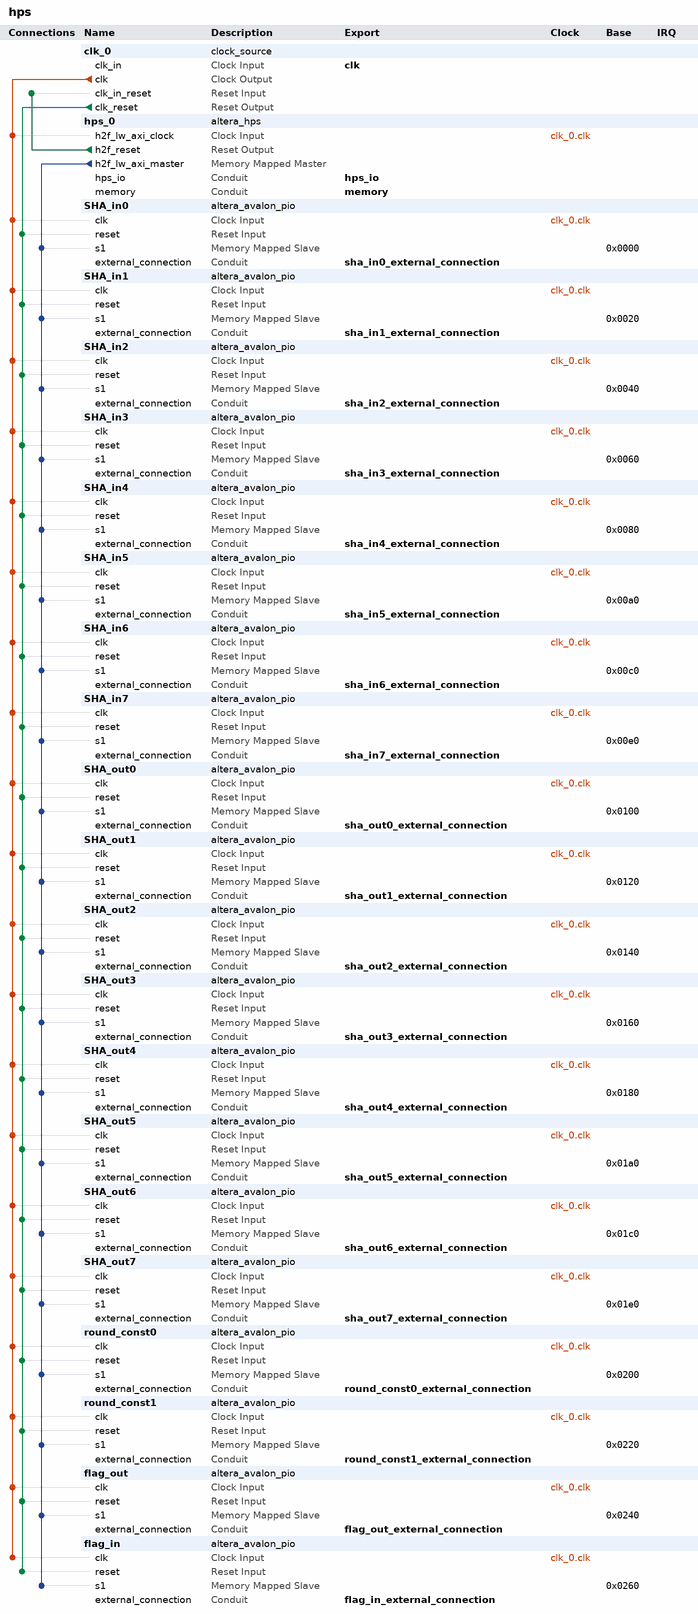
[diagram p0: system contents]
# Platform Designer (Qsys) system hps, Cyclone V 5CSXFC6D6F31C6
# Parameters at their usual value, and those the tool derives, are not listed.
package require -exact qsys 18.1
create_system hps
set_project_property DEVICE_FAMILY {Cyclone V}
set_project_property DEVICE 5CSXFC6D6F31C6

add_instance clk_0 clock_source 18.1
set_instance_parameter_value clk_0 clockFrequency 50000000

add_instance hps_0 altera_hps 18.1
set_instance_parameter_value hps_0 EMAC1_Mode RGMII
set_instance_parameter_value hps_0 EMAC1_PinMuxing {HPS I/O Set 0}
set_instance_parameter_value hps_0 F2SCLK_COLDRST_Enable false
set_instance_parameter_value hps_0 F2SCLK_DBGRST_Enable false
set_instance_parameter_value hps_0 F2SCLK_WARMRST_Enable false
set_instance_parameter_value hps_0 F2SINTERRUPT_Enable false
set_instance_parameter_value hps_0 F2S_Width 0
set_instance_parameter_value hps_0 FPGA_PERIPHERAL_OUTPUT_CLOCK_FREQ_EMAC0_GTX_CLK 125
set_instance_parameter_value hps_0 FPGA_PERIPHERAL_OUTPUT_CLOCK_FREQ_EMAC0_MD_CLK 2.5
set_instance_parameter_value hps_0 FPGA_PERIPHERAL_OUTPUT_CLOCK_FREQ_EMAC1_GTX_CLK 125
set_instance_parameter_value hps_0 FPGA_PERIPHERAL_OUTPUT_CLOCK_FREQ_EMAC1_MD_CLK 2.5
set_instance_parameter_value hps_0 HPS_PROTOCOL DDR3
set_instance_parameter_value hps_0 I2C0_Mode N/A
set_instance_parameter_value hps_0 I2C0_PinMuxing Unused
set_instance_parameter_value hps_0 I2C1_Mode N/A
set_instance_parameter_value hps_0 I2C1_PinMuxing Unused
set_instance_parameter_value hps_0 LWH2F_Enable true
set_instance_parameter_value hps_0 MEM_BANKADDR_WIDTH 3
set_instance_parameter_value hps_0 MEM_CLK_FREQ 400.0
set_instance_parameter_value hps_0 MEM_CLK_FREQ_MAX 400.0
set_instance_parameter_value hps_0 MEM_COL_ADDR_WIDTH 10
set_instance_parameter_value hps_0 MEM_DQ_WIDTH 32
set_instance_parameter_value hps_0 MEM_DRV_STR RZQ/6
set_instance_parameter_value hps_0 MEM_ROW_ADDR_WIDTH 15
set_instance_parameter_value hps_0 MEM_RTT_NOM RZQ/6
set_instance_parameter_value hps_0 MEM_RTT_WR {Dynamic ODT off}
set_instance_parameter_value hps_0 MEM_TCL 11
set_instance_parameter_value hps_0 MEM_TFAW_NS 45.0
set_instance_parameter_value hps_0 MEM_TRAS_NS 35.0
set_instance_parameter_value hps_0 MEM_TRCD_NS 13.75
set_instance_parameter_value hps_0 MEM_TRFC_NS 260.0
set_instance_parameter_value hps_0 MEM_TRP_NS 13.75
set_instance_parameter_value hps_0 MEM_VENDOR Micron
set_instance_parameter_value hps_0 MEM_WTCL 7
set_instance_parameter_value hps_0 QSPI_Mode N/A
set_instance_parameter_value hps_0 QSPI_PinMuxing Unused
set_instance_parameter_value hps_0 REF_CLK_FREQ 25.0
set_instance_parameter_value hps_0 S2FCLK_USER2CLK 5
set_instance_parameter_value hps_0 S2F_Width 0
set_instance_parameter_value hps_0 SDIO_Mode {4-bit Data}
set_instance_parameter_value hps_0 SDIO_PinMuxing {HPS I/O Set 0}
set_instance_parameter_value hps_0 SPIM1_Mode N/A
set_instance_parameter_value hps_0 SPIM1_PinMuxing Unused
set_instance_parameter_value hps_0 STM_Enable false
set_instance_parameter_value hps_0 TIMING_BOARD_AC_SKEW 0.02
set_instance_parameter_value hps_0 TIMING_BOARD_AC_TO_CK_SKEW 0.01
set_instance_parameter_value hps_0 TIMING_BOARD_DQ_TO_DQS_SKEW 0.05
set_instance_parameter_value hps_0 TIMING_BOARD_MAX_CK_DELAY 0.03
set_instance_parameter_value hps_0 TIMING_BOARD_MAX_DQS_DELAY 0.02
set_instance_parameter_value hps_0 TIMING_BOARD_SKEW_BETWEEN_DQS 0.06
set_instance_parameter_value hps_0 TIMING_BOARD_SKEW_CKDQS_DIMM_MAX 0.12
set_instance_parameter_value hps_0 TIMING_BOARD_SKEW_CKDQS_DIMM_MIN 0.06
set_instance_parameter_value hps_0 TIMING_BOARD_SKEW_WITHIN_DQS 0.01
set_instance_parameter_value hps_0 TIMING_TDH 65
set_instance_parameter_value hps_0 TIMING_TDQSCK 255
set_instance_parameter_value hps_0 TIMING_TDQSQ 125
set_instance_parameter_value hps_0 TIMING_TDS 30
set_instance_parameter_value hps_0 TIMING_TIH 140
set_instance_parameter_value hps_0 TIMING_TIS 190
set_instance_parameter_value hps_0 TIMING_TQSH 0.4
set_instance_parameter_value hps_0 UART0_Mode {No Flow Control}
set_instance_parameter_value hps_0 UART0_PinMuxing {HPS I/O Set 0}
set_instance_parameter_value hps_0 USB1_Mode SDR
set_instance_parameter_value hps_0 USB1_PinMuxing {HPS I/O Set 0}
set_instance_parameter_value hps_0 desired_cfg_clk_mhz 100.0
set_instance_parameter_value hps_0 desired_qspi_clk_mhz 400.0

add_instance SHA_in0 altera_avalon_pio 18.1
set_instance_parameter_value SHA_in0 direction Output
set_instance_parameter_value SHA_in0 width 32

add_instance SHA_in1 altera_avalon_pio 18.1
set_instance_parameter_value SHA_in1 direction Output
set_instance_parameter_value SHA_in1 width 32

add_instance SHA_in2 altera_avalon_pio 18.1
set_instance_parameter_value SHA_in2 direction Output
set_instance_parameter_value SHA_in2 width 32

add_instance SHA_in3 altera_avalon_pio 18.1
set_instance_parameter_value SHA_in3 direction Output
set_instance_parameter_value SHA_in3 width 32

add_instance SHA_in4 altera_avalon_pio 18.1
set_instance_parameter_value SHA_in4 direction Output
set_instance_parameter_value SHA_in4 width 32

add_instance SHA_in5 altera_avalon_pio 18.1
set_instance_parameter_value SHA_in5 direction Output
set_instance_parameter_value SHA_in5 width 32

add_instance SHA_in6 altera_avalon_pio 18.1
set_instance_parameter_value SHA_in6 direction Output
set_instance_parameter_value SHA_in6 width 32

add_instance SHA_in7 altera_avalon_pio 18.1
set_instance_parameter_value SHA_in7 direction Output
set_instance_parameter_value SHA_in7 width 32

add_instance SHA_out0 altera_avalon_pio 18.1
set_instance_parameter_value SHA_out0 direction Input
set_instance_parameter_value SHA_out0 width 32

add_instance SHA_out1 altera_avalon_pio 18.1
set_instance_parameter_value SHA_out1 direction Input
set_instance_parameter_value SHA_out1 width 32

add_instance SHA_out2 altera_avalon_pio 18.1
set_instance_parameter_value SHA_out2 direction Input
set_instance_parameter_value SHA_out2 width 32

add_instance SHA_out3 altera_avalon_pio 18.1
set_instance_parameter_value SHA_out3 direction Input
set_instance_parameter_value SHA_out3 width 32

add_instance SHA_out4 altera_avalon_pio 18.1
set_instance_parameter_value SHA_out4 direction Input
set_instance_parameter_value SHA_out4 width 32

add_instance SHA_out5 altera_avalon_pio 18.1
set_instance_parameter_value SHA_out5 direction Input
set_instance_parameter_value SHA_out5 width 32

add_instance SHA_out6 altera_avalon_pio 18.1
set_instance_parameter_value SHA_out6 direction Input
set_instance_parameter_value SHA_out6 width 32

add_instance SHA_out7 altera_avalon_pio 18.1
set_instance_parameter_value SHA_out7 direction Input
set_instance_parameter_value SHA_out7 width 32

add_instance round_const0 altera_avalon_pio 18.1
set_instance_parameter_value round_const0 direction Output
set_instance_parameter_value round_const0 width 32

add_instance round_const1 altera_avalon_pio 18.1
set_instance_parameter_value round_const1 direction Output
set_instance_parameter_value round_const1 width 32

add_instance flag_out altera_avalon_pio 18.1
set_instance_parameter_value flag_out direction Output
set_instance_parameter_value flag_out width 1

add_instance flag_in altera_avalon_pio 18.1
set_instance_parameter_value flag_in direction Input
set_instance_parameter_value flag_in width 1

# connections
add_connection clk_0.clk flag_in.clk clock
add_connection clk_0.clk flag_out.clk clock
add_connection clk_0.clk hps_0.h2f_lw_axi_clock clock
add_connection clk_0.clk round_const0.clk clock
add_connection clk_0.clk round_const1.clk clock
add_connection clk_0.clk SHA_in0.clk clock
add_connection clk_0.clk SHA_in1.clk clock
add_connection clk_0.clk SHA_in2.clk clock
add_connection clk_0.clk SHA_in3.clk clock
add_connection clk_0.clk SHA_in4.clk clock
add_connection clk_0.clk SHA_in5.clk clock
add_connection clk_0.clk SHA_in6.clk clock
add_connection clk_0.clk SHA_in7.clk clock
add_connection clk_0.clk SHA_out0.clk clock
add_connection clk_0.clk SHA_out1.clk clock
add_connection clk_0.clk SHA_out2.clk clock
add_connection clk_0.clk SHA_out3.clk clock
add_connection clk_0.clk SHA_out4.clk clock
add_connection clk_0.clk SHA_out5.clk clock
add_connection clk_0.clk SHA_out6.clk clock
add_connection clk_0.clk SHA_out7.clk clock
add_connection clk_0.clk_reset flag_in.reset reset
add_connection clk_0.clk_reset flag_out.reset reset
add_connection clk_0.clk_reset round_const0.reset reset
add_connection clk_0.clk_reset round_const1.reset reset
add_connection clk_0.clk_reset SHA_in0.reset reset
add_connection clk_0.clk_reset SHA_in1.reset reset
add_connection clk_0.clk_reset SHA_in2.reset reset
add_connection clk_0.clk_reset SHA_in3.reset reset
add_connection clk_0.clk_reset SHA_in4.reset reset
add_connection clk_0.clk_reset SHA_in5.reset reset
add_connection clk_0.clk_reset SHA_in6.reset reset
add_connection clk_0.clk_reset SHA_in7.reset reset
add_connection clk_0.clk_reset SHA_out0.reset reset
add_connection clk_0.clk_reset SHA_out1.reset reset
add_connection clk_0.clk_reset SHA_out2.reset reset
add_connection clk_0.clk_reset SHA_out3.reset reset
add_connection clk_0.clk_reset SHA_out4.reset reset
add_connection clk_0.clk_reset SHA_out5.reset reset
add_connection clk_0.clk_reset SHA_out6.reset reset
add_connection clk_0.clk_reset SHA_out7.reset reset
add_connection hps_0.h2f_reset clk_0.clk_in_reset reset
add_connection hps_0.h2f_lw_axi_master flag_in.s1 avalon
set_connection_parameter_value hps_0.h2f_lw_axi_master/flag_in.s1 baseAddress 0x0260
add_connection hps_0.h2f_lw_axi_master flag_out.s1 avalon
set_connection_parameter_value hps_0.h2f_lw_axi_master/flag_out.s1 baseAddress 0x0240
add_connection hps_0.h2f_lw_axi_master round_const0.s1 avalon
set_connection_parameter_value hps_0.h2f_lw_axi_master/round_const0.s1 baseAddress 0x0200
add_connection hps_0.h2f_lw_axi_master round_const1.s1 avalon
set_connection_parameter_value hps_0.h2f_lw_axi_master/round_const1.s1 baseAddress 0x0220
add_connection hps_0.h2f_lw_axi_master SHA_in0.s1 avalon
set_connection_parameter_value hps_0.h2f_lw_axi_master/SHA_in0.s1 baseAddress 0x0000
add_connection hps_0.h2f_lw_axi_master SHA_in1.s1 avalon
set_connection_parameter_value hps_0.h2f_lw_axi_master/SHA_in1.s1 baseAddress 0x0020
add_connection hps_0.h2f_lw_axi_master SHA_in2.s1 avalon
set_connection_parameter_value hps_0.h2f_lw_axi_master/SHA_in2.s1 baseAddress 0x0040
add_connection hps_0.h2f_lw_axi_master SHA_in3.s1 avalon
set_connection_parameter_value hps_0.h2f_lw_axi_master/SHA_in3.s1 baseAddress 0x0060
add_connection hps_0.h2f_lw_axi_master SHA_in4.s1 avalon
set_connection_parameter_value hps_0.h2f_lw_axi_master/SHA_in4.s1 baseAddress 0x0080
add_connection hps_0.h2f_lw_axi_master SHA_in5.s1 avalon
set_connection_parameter_value hps_0.h2f_lw_axi_master/SHA_in5.s1 baseAddress 0x00a0
add_connection hps_0.h2f_lw_axi_master SHA_in6.s1 avalon
set_connection_parameter_value hps_0.h2f_lw_axi_master/SHA_in6.s1 baseAddress 0x00c0
add_connection hps_0.h2f_lw_axi_master SHA_in7.s1 avalon
set_connection_parameter_value hps_0.h2f_lw_axi_master/SHA_in7.s1 baseAddress 0x00e0
add_connection hps_0.h2f_lw_axi_master SHA_out0.s1 avalon
set_connection_parameter_value hps_0.h2f_lw_axi_master/SHA_out0.s1 baseAddress 0x0100
add_connection hps_0.h2f_lw_axi_master SHA_out1.s1 avalon
set_connection_parameter_value hps_0.h2f_lw_axi_master/SHA_out1.s1 baseAddress 0x0120
add_connection hps_0.h2f_lw_axi_master SHA_out2.s1 avalon
set_connection_parameter_value hps_0.h2f_lw_axi_master/SHA_out2.s1 baseAddress 0x0140
add_connection hps_0.h2f_lw_axi_master SHA_out3.s1 avalon
set_connection_parameter_value hps_0.h2f_lw_axi_master/SHA_out3.s1 baseAddress 0x0160
add_connection hps_0.h2f_lw_axi_master SHA_out4.s1 avalon
set_connection_parameter_value hps_0.h2f_lw_axi_master/SHA_out4.s1 baseAddress 0x0180
add_connection hps_0.h2f_lw_axi_master SHA_out5.s1 avalon
set_connection_parameter_value hps_0.h2f_lw_axi_master/SHA_out5.s1 baseAddress 0x01a0
add_connection hps_0.h2f_lw_axi_master SHA_out6.s1 avalon
set_connection_parameter_value hps_0.h2f_lw_axi_master/SHA_out6.s1 baseAddress 0x01c0
add_connection hps_0.h2f_lw_axi_master SHA_out7.s1 avalon
set_connection_parameter_value hps_0.h2f_lw_axi_master/SHA_out7.s1 baseAddress 0x01e0

# exported interfaces
add_interface clk clock sink
set_interface_property clk EXPORT_OF clk_0.clk_in
add_interface flag_in_external_connection conduit end
set_interface_property flag_in_external_connection EXPORT_OF flag_in.external_connection
add_interface flag_out_external_connection conduit end
set_interface_property flag_out_external_connection EXPORT_OF flag_out.external_connection
add_interface hps_io conduit end
set_interface_property hps_io EXPORT_OF hps_0.hps_io
add_interface memory conduit end
set_interface_property memory EXPORT_OF hps_0.memory
add_interface round_const0_external_connection conduit end
set_interface_property round_const0_external_connection EXPORT_OF round_const0.external_connection
add_interface round_const1_external_connection conduit end
set_interface_property round_const1_external_connection EXPORT_OF round_const1.external_connection
add_interface sha_in0_external_connection conduit end
set_interface_property sha_in0_external_connection EXPORT_OF SHA_in0.external_connection
add_interface sha_in1_external_connection conduit end
set_interface_property sha_in1_external_connection EXPORT_OF SHA_in1.external_connection
add_interface sha_in2_external_connection conduit end
set_interface_property sha_in2_external_connection EXPORT_OF SHA_in2.external_connection
add_interface sha_in3_external_connection conduit end
set_interface_property sha_in3_external_connection EXPORT_OF SHA_in3.external_connection
add_interface sha_in4_external_connection conduit end
set_interface_property sha_in4_external_connection EXPORT_OF SHA_in4.external_connection
add_interface sha_in5_external_connection conduit end
set_interface_property sha_in5_external_connection EXPORT_OF SHA_in5.external_connection
add_interface sha_in6_external_connection conduit end
set_interface_property sha_in6_external_connection EXPORT_OF SHA_in6.external_connection
add_interface sha_in7_external_connection conduit end
set_interface_property sha_in7_external_connection EXPORT_OF SHA_in7.external_connection
add_interface sha_out0_external_connection conduit end
set_interface_property sha_out0_external_connection EXPORT_OF SHA_out0.external_connection
add_interface sha_out1_external_connection conduit end
set_interface_property sha_out1_external_connection EXPORT_OF SHA_out1.external_connection
add_interface sha_out2_external_connection conduit end
set_interface_property sha_out2_external_connection EXPORT_OF SHA_out2.external_connection
add_interface sha_out3_external_connection conduit end
set_interface_property sha_out3_external_connection EXPORT_OF SHA_out3.external_connection
add_interface sha_out4_external_connection conduit end
set_interface_property sha_out4_external_connection EXPORT_OF SHA_out4.external_connection
add_interface sha_out5_external_connection conduit end
set_interface_property sha_out5_external_connection EXPORT_OF SHA_out5.external_connection
add_interface sha_out6_external_connection conduit end
set_interface_property sha_out6_external_connection EXPORT_OF SHA_out6.external_connection
add_interface sha_out7_external_connection conduit end
set_interface_property sha_out7_external_connection EXPORT_OF SHA_out7.external_connection

set_interconnect_requirement {$system} qsys_mm.clockCrossingAdapter HANDSHAKE
set_interconnect_requirement {$system} qsys_mm.enableEccProtection FALSE
set_interconnect_requirement {$system} qsys_mm.insertDefaultSlave FALSE
set_interconnect_requirement {$system} qsys_mm.maxAdditionalLatency 1

save_system hps.qsys
